# Altium schematic sheet Power_Budget.SchDoc
size A4; SheetNumber: 2; SheetTotal: 9
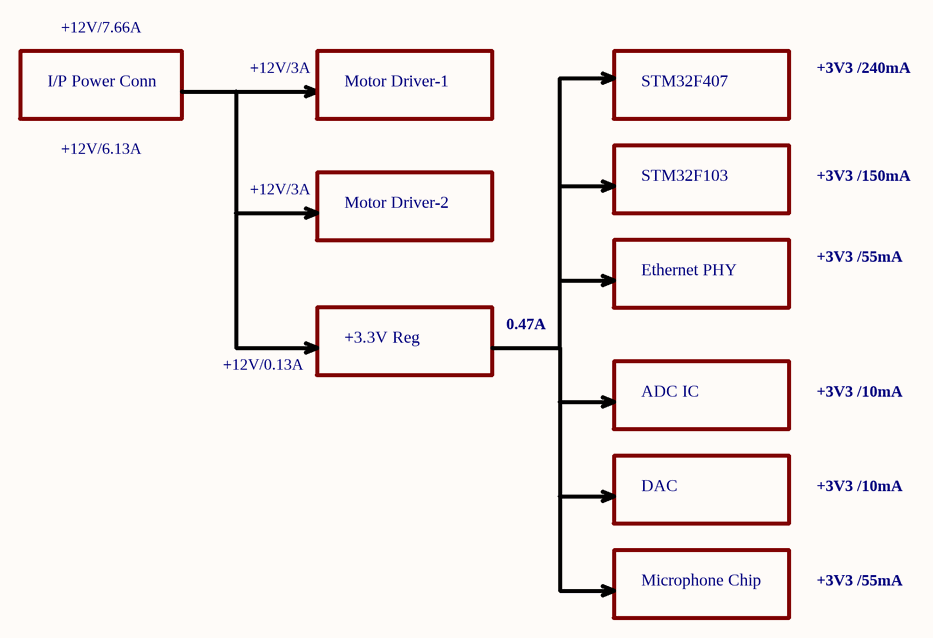
[diagram p0: Power_Budget.SchDoc]

## Notes on the sheet
- I/P Power Conn
- +12V/7.66A
- +12V/3A
- Motor Driver-1
- STM32F407
- +3V3 /240mA
- +12V/6.13A
- Motor Driver-2
- STM32F103
- +3V3 /150mA
- Ethernet PHY
- +3V3 /55mA
- +3.3V Reg
- 0.47A
- +12V/0.13A
- ADC IC
- +3V3 /10mA
- DAC
- Microphone Chip